# Altium schematic sheet Classes.SchDoc: CLASS DEMO
size 431 x 279 mm; Revision: A; SheetNumber: 2; SheetTotal: 2; Title2: FUSE BOARD
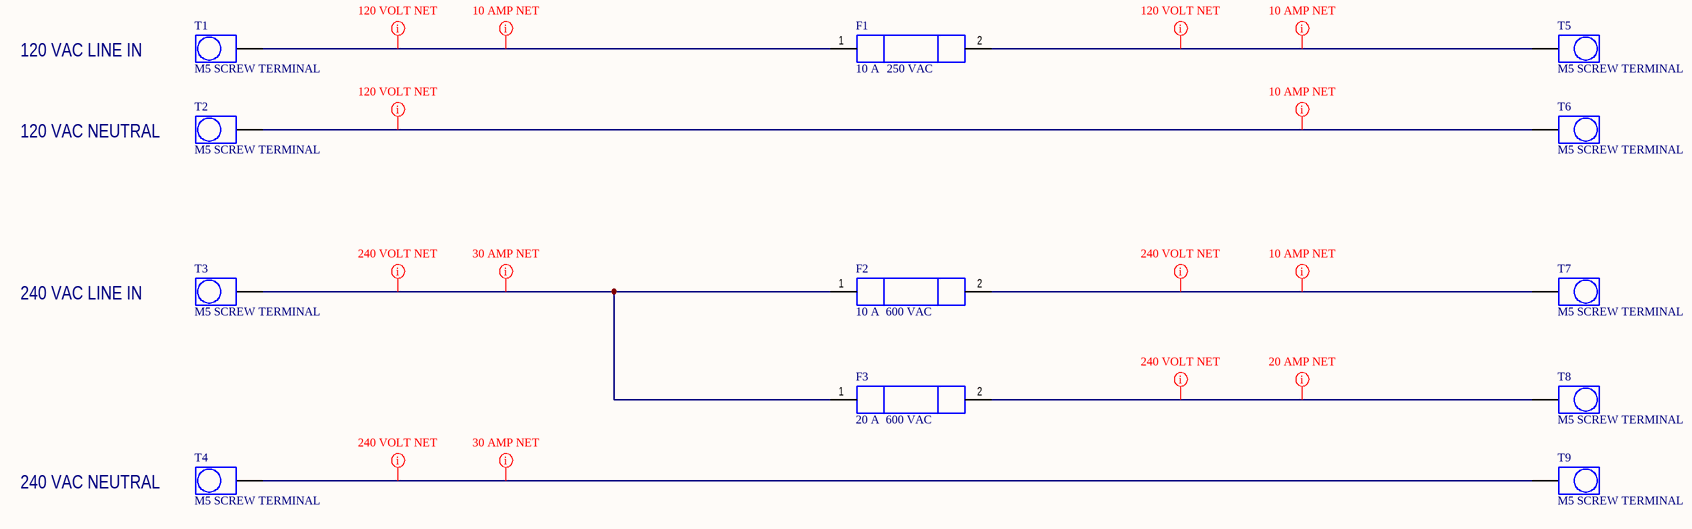
[diagram p0: Classes.SchDoc]

## Parts
F1  10 A  VOLTAGE_RATING: 250 VAC  [1/4 FUSE]
F2  10 A  VOLTAGE_RATING: 600 VAC  [13/32 FUSE]
F3  20 A  VOLTAGE_RATING: 600 VAC  [13/32 FUSE]
T1  M5 SCREW TERMINAL  [M5 TERMINAL]
T2  M5 SCREW TERMINAL  [M5 TERMINAL]
T3  M5 SCREW TERMINAL  [M5 TERMINAL]
T4  M5 SCREW TERMINAL  [M5 TERMINAL]
T5  M5 SCREW TERMINAL  [M5 TERMINAL]
T6  M5 SCREW TERMINAL  [M5 TERMINAL]
T7  M5 SCREW TERMINAL  [M5 TERMINAL]
T8  M5 SCREW TERMINAL  [M5 TERMINAL]
T9  M5 SCREW TERMINAL  [M5 TERMINAL]

## Nets
NetF1_1: F1.1 T1.1
NetF1_2: F1.2 T5.1
NetF2_1: F2.1 F3.1 T3.1
NetF2_2: F2.2 T7.1
NetF3_2: F3.2 T8.1
NetT2_1: T2.1 T6.1
NetT4_1: T4.1 T9.1

## Layout directives
net class VOLT_120: NetF1_1, NetF1_2, NetT2_1
net class VOLT_240: NetF2_1, NetF2_2, NetF3_2, NetT4_1
net class AMP_10: NetF1_1, NetF1_2, NetF2_2, NetT2_1
net class AMP_20: NetF3_2
net class AMP_30: NetF2_1, NetT4_1

## Notes on the sheet
- 120 VAC LINE IN
- 120 VAC NEUTRAL
- 240 VAC LINE IN
- 240 VAC NEUTRAL
- 8
- 7
- 6
- 5
- 4
- 3
- DWG. NO.
- REV.
- SHT.
- 2
- 1
- THIS DOCUMENT AND THE DATA DISCLOSED HEREIN OR HEREWITH IS THE PROPERTY OF ALTIUM LIMITED AND MAY BE FREELY DISTRIBUTED IN WHOLE. NO RIGHTS ARE RESERVED OR EXPRESS OR IMPLIED WARANTEE GIVEN.
- REVISION
- DESCRIPTION
- DATE
- APPROVED
- F
- E
- D
- C
- B
- A
- TITLE
- SCALE:
- SIZE
- CAGE CODE
- FILE NAME
- DWG NO.
- SHEET
- OF
- REV

## Library data of the parts
F1 = 10 AMP 250 VAC FUSE: MANUFACTURE: COOPER BUSSMAN; PART NUMBER: GBB-10-R; ClassName: 120_VOLT; CURRENT_RATING: 10 A
F2 = 10 AMP 600 VAC FUSE: MANUFACTURE: COOPER BUSSMAN; PART NUMBER: KTK-R-10; ClassName: 240_VOLT; CURRENT_RATING: 10 A
F3 = 20 AMP 600 VAC FUSE: MANUFACTURE: COOPER BUSSMAN; PART NUMBER: KTK-R-20; ClassName: 240_VOLT; CURRENT_RATING: 20 A
T1-T9 = TERMINAL